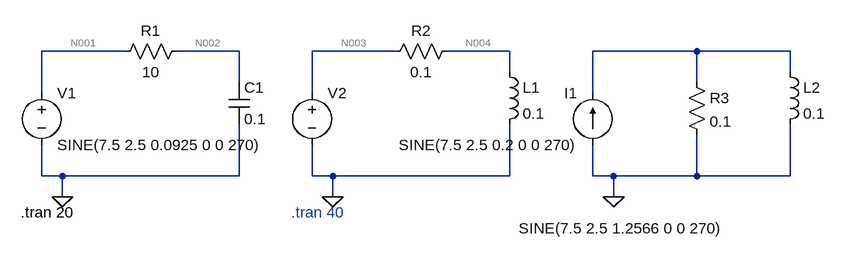
[diagram p0: schematic lead_lag_ex2.asc]
lead_lag_ex2.asc, the LTspice schematic file:
Version 4.1
SHEET 1 1256 680
WIRE 144 64 16 64
WIRE 320 64 224 64
WIRE 560 64 432 64
WIRE 736 64 640 64
WIRE 1024 64 864 64
WIRE 1168 64 1024 64
WIRE 736 96 736 64
WIRE 1168 96 1168 64
WIRE 320 112 320 64
WIRE 1024 112 1024 64
WIRE 16 128 16 64
WIRE 432 128 432 64
WIRE 864 128 864 64
WIRE 16 256 16 208
WIRE 48 256 16 256
WIRE 320 256 320 176
WIRE 320 256 48 256
WIRE 432 256 432 208
WIRE 464 256 432 256
WIRE 736 256 736 176
WIRE 736 256 464 256
WIRE 864 256 864 208
WIRE 896 256 864 256
WIRE 1024 256 1024 192
WIRE 1024 256 896 256
WIRE 1168 256 1168 176
WIRE 1168 256 1024 256
WIRE 48 288 48 256
WIRE 464 288 464 256
WIRE 896 288 896 256
FLAG 48 288 0
FLAG 464 288 0
FLAG 896 288 0
SYMBOL voltage 16 112 R0
WINDOW 123 0 0 Left 0
WINDOW 39 0 0 Left 0
SYMATTR InstName V1
SYMATTR Value SINE(7.5 2.5 0.0925 0 0 270)
SYMBOL res 240 48 R90
WINDOW 0 0 56 VBottom 2
WINDOW 3 32 56 VTop 2
SYMATTR InstName R1
SYMATTR Value 10
SYMBOL cap 304 112 R0
SYMATTR InstName C1
SYMATTR Value 0.1
SYMBOL voltage 432 112 R0
WINDOW 123 0 0 Left 0
WINDOW 39 0 0 Left 0
WINDOW 3 318 225 Left 2
SYMATTR InstName V2
SYMATTR Value SINE(7.5 2.5 1.2566 0 0 270)
SYMBOL res 656 48 R90
WINDOW 0 0 56 VBottom 2
WINDOW 3 32 56 VTop 2
SYMATTR InstName R2
SYMATTR Value 0.1
SYMBOL ind 720 80 R0
SYMATTR InstName L1
SYMATTR Value 0.1
SYMBOL ind 1152 80 R0
SYMATTR InstName L2
SYMATTR Value 0.1
SYMBOL res 1008 96 R0
SYMATTR InstName R3
SYMATTR Value 0.1
SYMBOL current 864 208 R180
WINDOW 0 24 80 Left 2
WINDOW 3 24 0 Left 2
WINDOW 123 0 0 Left 0
WINDOW 39 0 0 Left 0
SYMATTR InstName I1
SYMATTR Value SINE(7.5 2.5 0.2 0 0 270)
TEXT -16 312 Left 2 !.tran 20
TEXT 400 312 Left 2 ;.tran 40

The netlist it stands for:
* lead_lag_ex2.asc
V1 N001 0 SINE(7.5 2.5 0.0925 0 0 270)
R1 N002 N001 10
C1 N002 0 0.1
V2 N003 0 SINE(7.5 2.5 1.2566 0 0 270)
R2 N004 N003 0.1
L1 N004 0 0.1
L2 N005 0 0.1
R3 N005 0 0.1
I1 0 N005 SINE(7.5 2.5 0.2 0 0 270)
.tran 20
* .tran 40
.backanno
.end

* Results of the author's LTspice run, read from the files saved beside the schematic
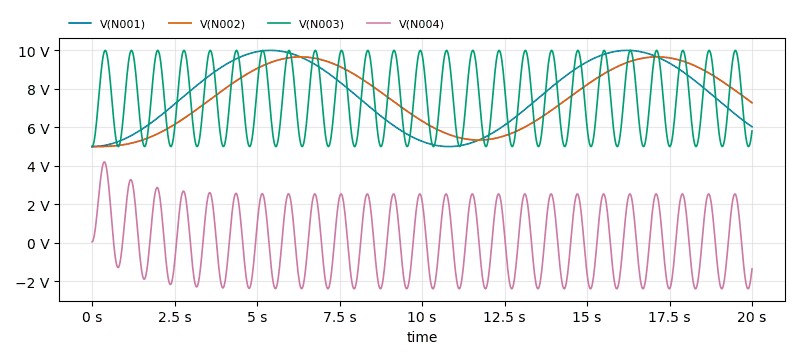
[diagram p1: Transient Analysis of lead_lag_ex2.asc, plotted from the saved traces]
* Transient Analysis, 1 run:
*   V(N001): min 5 V, max 10 V, average 7.674 V, rms 7.865 V, last 6.031 V
*   V(N002): min 5 V, max 9.661 V, average 7.56 V, rms 7.725 V, last 7.28 V
*   V(N003): min 5 V, max 10 V, average 7.488 V, rms 7.695 V, last 5.812 V
*   V(N004): min -2.391 V, max 4.203 V, average 184.1 mV, rms 1.794 V, last -1.358 V